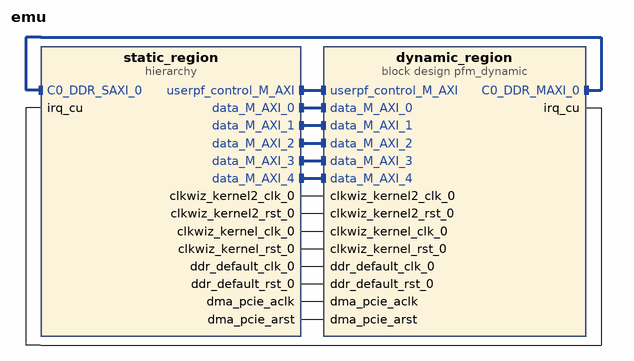
[diagram p0: block diagram of the top level]
# Vivado block design emu, xcvu9p-flgb2104-2-i, Vivado 2021.2
create_bd_design emu

create_bd_cell -type hier static_region
create_bd_cell -type container -reference pfm_dynamic dynamic_region

# ---- hierarchy /static_region ----
current_bd_instance /static_region
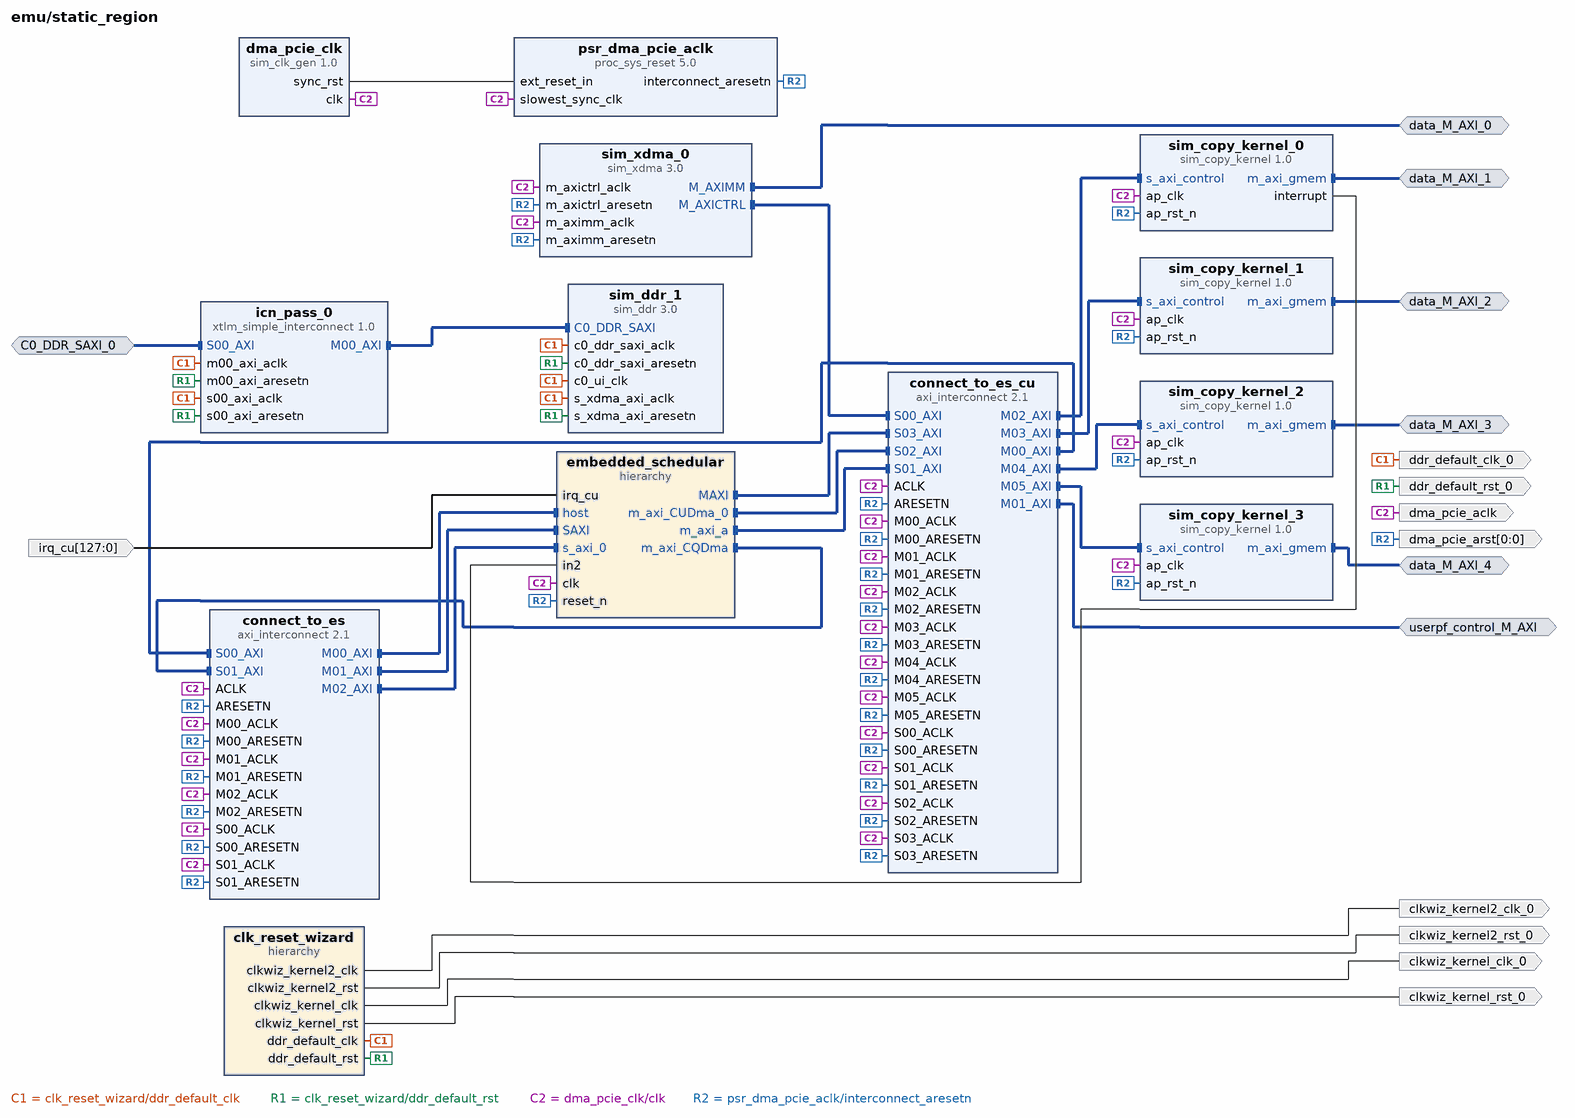
[diagram p1: block diagram inside /static_region]
create_bd_intf_pin -mode Slave -vlnv xilinx.com:interface:aximm_rtl:1.0 C0_DDR_SAXI_0
create_bd_intf_pin -mode Master -vlnv xilinx.com:interface:aximm_rtl:1.0 data_M_AXI_0
create_bd_intf_pin -mode Master -vlnv xilinx.com:interface:aximm_rtl:1.0 data_M_AXI_1
create_bd_intf_pin -mode Master -vlnv xilinx.com:interface:aximm_rtl:1.0 data_M_AXI_2
create_bd_intf_pin -mode Master -vlnv xilinx.com:interface:aximm_rtl:1.0 data_M_AXI_3
create_bd_intf_pin -mode Master -vlnv xilinx.com:interface:aximm_rtl:1.0 data_M_AXI_4
create_bd_intf_pin -mode Master -vlnv xilinx.com:interface:aximm_rtl:1.0 userpf_control_M_AXI
create_bd_pin -dir O -type clk clkwiz_kernel2_clk_0
create_bd_pin -dir O -type clk clkwiz_kernel_clk_0
create_bd_pin -dir O -type rst clkwiz_kernel2_rst_0
create_bd_pin -dir O -type rst clkwiz_kernel_rst_0
create_bd_pin -dir O -type clk ddr_default_clk_0
create_bd_pin -dir O -type rst ddr_default_rst_0
create_bd_pin -dir O -type clk dma_pcie_aclk
create_bd_pin -dir I -from 127 -to 0 -type intr irq_cu
create_bd_pin -dir O -from 0 -to 0 -type rst dma_pcie_arst

create_bd_cell -type hier clk_reset_wizard
create_bd_cell -type hier embedded_schedular
create_bd_cell -type ip -vlnv xilinx.com:ip:proc_sys_reset:5.0 psr_dma_pcie_aclk
create_bd_cell -type ip -vlnv xilinx.com:user:sim_ddr:3.0 sim_ddr_1
set_property -dict [list \
  CONFIG.C0_A00_BASE_ADDR 0x0 \
  CONFIG.C0_A00_HIGH_ADDR 0x0000000400000000 \
  CONFIG.C0_APP_ADDR_WIDTH 31 \
  CONFIG.C0_APP_DATA_WIDTH 512 \
  CONFIG.C0_BANK_GROUP_WIDTH 2 \
  CONFIG.C0_BANK_WIDTH 2 \
  CONFIG.C0_COLUMN_WIDTH 10 \
  CONFIG.C0_DATA_WIDTH 72 \
  CONFIG.C0_DDR_SAXI_ADDR_WIDTH 34 \
  CONFIG.C0_DDR_SAXI_BASEADDR 0x0000000000000000 \
  CONFIG.C0_DDR_SAXI_DATA_WIDTH 512 \
  CONFIG.C0_DDR_SAXI_HIGHADDR 0x0000000400000000 \
  CONFIG.C0_MEMORY_PART MTA18ASF2G72PZ-2G3 \
  CONFIG.C0_MEM_ADDR_MAP ROW_COLUMN_BANK \
  CONFIG.C0_Mem_Add_Map ROW_COLUMN_BANK \
  CONFIG.C0_RANK_WIDTH 1 \
  CONFIG.C0_ROW_WIDTH 17 \
  CONFIG.C0_SIZE 16GB \
  CONFIG.C0_TIMEPERIOD_PS 833 \
  CONFIG.C0_TYPE ddr4 \
  CONFIG.C0_tCK 833 \
  CONFIG.C0_tCKE 0 \
  CONFIG.C0_tFAW 16 \
  CONFIG.C0_tMRD 2 \
  CONFIG.C0_tRAS 39 \
  CONFIG.C0_tRCD 17 \
  CONFIG.C0_tREFI 9363 \
  CONFIG.C0_tRFC 421 \
  CONFIG.C0_tRP 17 \
  CONFIG.C0_tRRD_L 6 \
  CONFIG.C0_tRRD_S 4 \
  CONFIG.C0_tRTP 10 \
  CONFIG.C0_tWR 19 \
  CONFIG.C0_tWTR_L 10 \
  CONFIG.C0_tWTR_S 4 \
  CONFIG.C_NUMBER_OF_GLOBAL_MEMORIES 1 \
] [get_bd_cells sim_ddr_1]
create_bd_cell -type ip -vlnv xilinx.com:ip:xtlm_simple_interconnect:1.0 icn_pass_0
set_property -dict [list \
  CONFIG.C_M00_AXI_ADDR_WIDTH 34 \
  CONFIG.C_M00_AXI_DATA_WIDTH 512 \
  CONFIG.C_NUM_MI 1 \
  CONFIG.C_NUM_SI 1 \
  CONFIG.C_S00_AXI_ADDR_WIDTH 64 \
  CONFIG.C_S00_AXI_DATA_WIDTH 512 \
] [get_bd_cells icn_pass_0]
create_bd_cell -type ip -vlnv xilinx.com:hls:sim_copy_kernel:1.0 sim_copy_kernel_0
create_bd_cell -type ip -vlnv xilinx.com:hls:sim_copy_kernel:1.0 sim_copy_kernel_1
create_bd_cell -type ip -vlnv xilinx.com:hls:sim_copy_kernel:1.0 sim_copy_kernel_2
create_bd_cell -type ip -vlnv xilinx.com:hls:sim_copy_kernel:1.0 sim_copy_kernel_3
create_bd_cell -type ip -vlnv xilinx.com:ip:axi_interconnect:2.1 connect_to_es
set_property -dict {CONFIG.NUM_MI 3 CONFIG.NUM_SI 2} [get_bd_cells connect_to_es]
create_bd_cell -type ip -vlnv xilinx.com:ip:axi_interconnect:2.1 connect_to_es_cu
set_property -dict {CONFIG.NUM_MI 6 CONFIG.NUM_SI 4} [get_bd_cells connect_to_es_cu]
create_bd_cell -type ip -vlnv xilinx.com:ip:sim_clk_gen:1.0 dma_pcie_clk
set_property -dict {CONFIG.FREQ_HZ 300000000.0} [get_bd_cells dma_pcie_clk]
create_bd_cell -type ip -vlnv xilinx.com:xilinx:sim_xdma:3.0 sim_xdma_0
set_property -dict [list \
  CONFIG.C_M_AXICTRL_ADDR_WIDTH 64 \
  CONFIG.C_M_AXICTRL_DATA_WIDTH 32 \
  CONFIG.C_M_AXIMM_ADDR_WIDTH 64 \
  CONFIG.C_M_AXIMM_ARUSER_WIDTH 32 \
  CONFIG.C_M_AXIMM_AWUSER_WIDTH 32 \
  CONFIG.C_M_AXIMM_DATA_WIDTH 32 \
] [get_bd_cells sim_xdma_0]

# ---- hierarchy /static_region/clk_reset_wizard ----
current_bd_instance /static_region/clk_reset_wizard
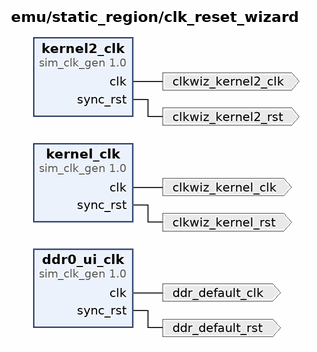
[diagram p2: block diagram inside /static_region/clk_reset_wizard]
create_bd_pin -dir O -type rst clkwiz_kernel2_rst
create_bd_pin -dir O -type rst clkwiz_kernel_rst
create_bd_pin -dir O -type clk ddr_default_clk
create_bd_pin -dir O -type rst ddr_default_rst
create_bd_pin -dir O -type clk clkwiz_kernel2_clk
create_bd_pin -dir O -type clk clkwiz_kernel_clk

create_bd_cell -type ip -vlnv xilinx.com:ip:sim_clk_gen:1.0 ddr0_ui_clk
set_property -dict {CONFIG.FREQ_HZ 300120048} [get_bd_cells ddr0_ui_clk]
create_bd_cell -type ip -vlnv xilinx.com:ip:sim_clk_gen:1.0 kernel2_clk
set_property -dict {CONFIG.FREQ_HZ 500000000} [get_bd_cells kernel2_clk]
create_bd_cell -type ip -vlnv xilinx.com:ip:sim_clk_gen:1.0 kernel_clk
set_property -dict {CONFIG.FREQ_HZ 300000000} [get_bd_cells kernel_clk]

# ---- hierarchy /static_region/embedded_schedular ----
current_bd_instance /static_region/embedded_schedular
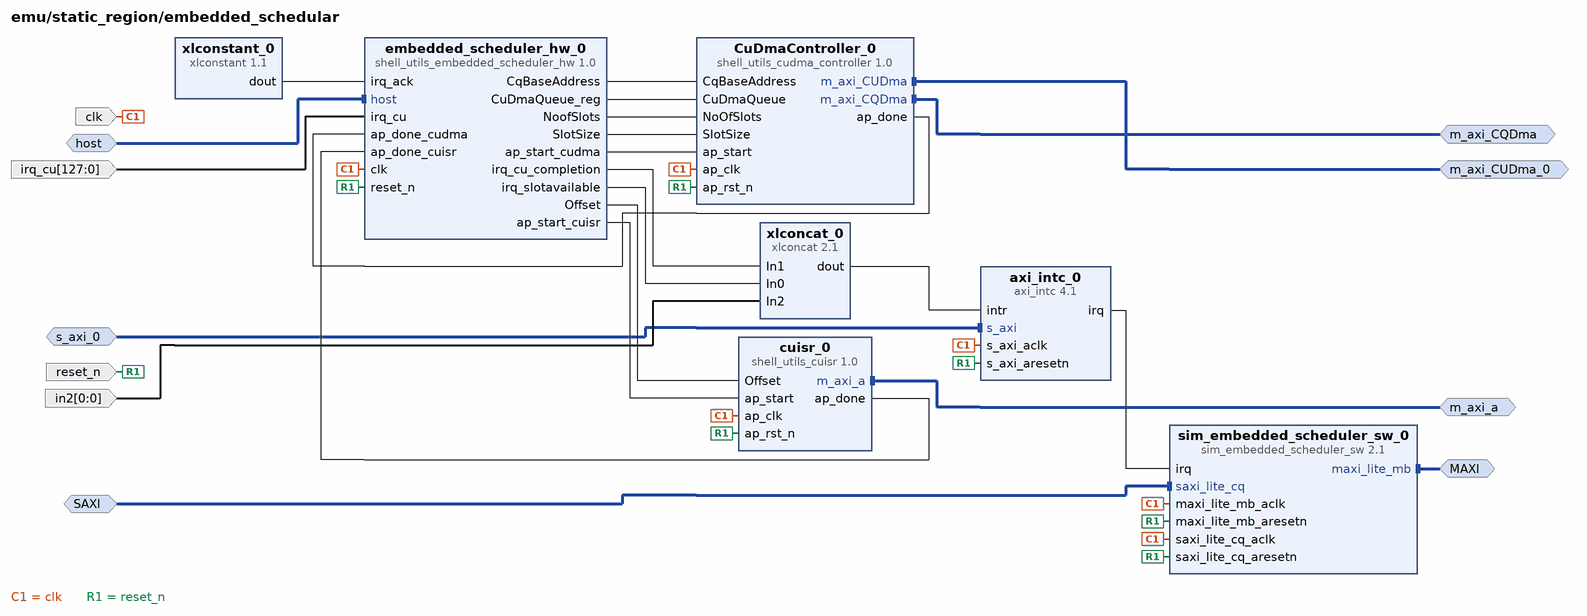
[diagram p3: block diagram inside /static_region/embedded_schedular]
create_bd_intf_pin -mode Master -vlnv xilinx.com:interface:aximm_rtl:1.0 MAXI
create_bd_intf_pin -mode Slave -vlnv xilinx.com:interface:aximm_rtl:1.0 SAXI
create_bd_intf_pin -mode Slave -vlnv xilinx.com:interface:aximm_rtl:1.0 host
create_bd_intf_pin -mode Master -vlnv xilinx.com:interface:aximm_rtl:1.0 m_axi_CQDma
create_bd_intf_pin -mode Master -vlnv xilinx.com:interface:aximm_rtl:1.0 m_axi_CUDma_0
create_bd_intf_pin -mode Master -vlnv xilinx.com:interface:aximm_rtl:1.0 m_axi_a
create_bd_intf_pin -mode Slave -vlnv xilinx.com:interface:aximm_rtl:1.0 s_axi_0
create_bd_pin -dir I -type clk clk
create_bd_pin -dir I -from 127 -to 0 -type intr irq_cu
create_bd_pin -dir I -type rst reset_n
create_bd_pin -dir I -from 0 -to 0 in2

create_bd_cell -type ip -vlnv xilinx.com:ip:shell_utils_embedded_scheduler_hw:1.0 embedded_scheduler_hw_0
create_bd_cell -type ip -vlnv xilinx.com:xilinx:sim_embedded_scheduler_sw:2.1 sim_embedded_scheduler_sw_0
create_bd_cell -type ip -vlnv xilinx.com:ip:shell_utils_cudma_controller:1.0 CuDmaController_0
create_bd_cell -type ip -vlnv xilinx.com:ip:axi_intc:4.1 axi_intc_0
set_property -dict [list \
  CONFIG.C_HAS_FAST 0 \
  CONFIG.C_IRQ_ACTIVE 1 \
  CONFIG.C_IRQ_IS_LEVEL 1 \
  CONFIG.C_KIND_OF_INTR 0xFFFFFFFC \
  CONFIG.C_KIND_OF_LVL 0xFFFFFFFF \
] [get_bd_cells axi_intc_0]
create_bd_cell -type ip -vlnv xilinx.com:ip:shell_utils_cuisr:1.0 cuisr_0
create_bd_cell -type ip -vlnv xilinx.com:ip:xlconcat:2.1 xlconcat_0
set_property -dict {CONFIG.NUM_PORTS 3 CONFIG.dout_width 3} [get_bd_cells xlconcat_0]
create_bd_cell -type ip -vlnv xilinx.com:ip:xlconstant:1.1 xlconstant_0
set_property -dict {CONFIG.CONST_VAL 0 CONFIG.CONST_WIDTH 16} [get_bd_cells xlconstant_0]

# ---- connections ----

current_bd_instance /static_region
connect_bd_intf_net [get_bd_intf_pins C0_DDR_SAXI_0] [get_bd_intf_pins icn_pass_0/S00_AXI]
connect_bd_intf_net [get_bd_intf_pins icn_pass_0/M00_AXI] [get_bd_intf_pins sim_ddr_1/C0_DDR_SAXI]
connect_bd_intf_net [get_bd_intf_pins connect_to_es/M00_AXI] [get_bd_intf_pins embedded_schedular/host]
connect_bd_intf_net [get_bd_intf_pins connect_to_es/M01_AXI] [get_bd_intf_pins embedded_schedular/SAXI]
connect_bd_intf_net [get_bd_intf_pins connect_to_es/M02_AXI] [get_bd_intf_pins embedded_schedular/s_axi_0]
connect_bd_intf_net [get_bd_intf_pins connect_to_es/S00_AXI] [get_bd_intf_pins connect_to_es_cu/M00_AXI]
connect_bd_intf_net [get_bd_intf_pins userpf_control_M_AXI] [get_bd_intf_pins connect_to_es_cu/M01_AXI]
connect_bd_intf_net [get_bd_intf_pins sim_copy_kernel_0/s_axi_control] [get_bd_intf_pins connect_to_es_cu/M02_AXI]
connect_bd_intf_net [get_bd_intf_pins sim_copy_kernel_1/s_axi_control] [get_bd_intf_pins connect_to_es_cu/M03_AXI]
connect_bd_intf_net [get_bd_intf_pins sim_copy_kernel_2/s_axi_control] [get_bd_intf_pins connect_to_es_cu/M04_AXI]
connect_bd_intf_net [get_bd_intf_pins sim_copy_kernel_3/s_axi_control] [get_bd_intf_pins connect_to_es_cu/M05_AXI]
connect_bd_intf_net -intf_net data_M_AXI_0_1_conn [get_bd_intf_pins data_M_AXI_0] [get_bd_intf_pins sim_xdma_0/M_AXIMM]
connect_bd_intf_net -intf_net data_M_AXI_1_1_conn [get_bd_intf_pins data_M_AXI_1] [get_bd_intf_pins sim_copy_kernel_0/m_axi_gmem]
connect_bd_intf_net -intf_net data_M_AXI_2_1_conn [get_bd_intf_pins data_M_AXI_2] [get_bd_intf_pins sim_copy_kernel_1/m_axi_gmem]
connect_bd_intf_net -intf_net data_M_AXI_3_1_conn [get_bd_intf_pins data_M_AXI_3] [get_bd_intf_pins sim_copy_kernel_2/m_axi_gmem]
connect_bd_intf_net -intf_net data_M_AXI_4_1_conn [get_bd_intf_pins data_M_AXI_4] [get_bd_intf_pins sim_copy_kernel_3/m_axi_gmem]
connect_bd_intf_net [get_bd_intf_pins connect_to_es_cu/S03_AXI] [get_bd_intf_pins embedded_schedular/MAXI]
connect_bd_intf_net [get_bd_intf_pins connect_to_es/S01_AXI] [get_bd_intf_pins embedded_schedular/m_axi_CQDma]
connect_bd_intf_net [get_bd_intf_pins connect_to_es_cu/S02_AXI] [get_bd_intf_pins embedded_schedular/m_axi_CUDma_0]
connect_bd_intf_net [get_bd_intf_pins connect_to_es_cu/S01_AXI] [get_bd_intf_pins embedded_schedular/m_axi_a]
connect_bd_intf_net [get_bd_intf_pins connect_to_es_cu/S00_AXI] [get_bd_intf_pins sim_xdma_0/M_AXICTRL]
connect_bd_net [get_bd_pins clk_reset_wizard/clkwiz_kernel2_clk] [get_bd_pins clkwiz_kernel2_clk_0]
connect_bd_net [get_bd_pins clk_reset_wizard/clkwiz_kernel2_rst] [get_bd_pins clkwiz_kernel2_rst_0]
connect_bd_net [get_bd_pins clk_reset_wizard/clkwiz_kernel_clk] [get_bd_pins clkwiz_kernel_clk_0]
connect_bd_net [get_bd_pins clk_reset_wizard/clkwiz_kernel_rst] [get_bd_pins clkwiz_kernel_rst_0]
connect_bd_net [get_bd_pins clk_reset_wizard/ddr_default_clk] \
  [get_bd_pins ddr_default_clk_0] [get_bd_pins sim_ddr_1/c0_ddr_saxi_aclk] [get_bd_pins icn_pass_0/s00_axi_aclk] \
  [get_bd_pins icn_pass_0/m00_axi_aclk] [get_bd_pins sim_ddr_1/c0_ui_clk] [get_bd_pins sim_ddr_1/s_xdma_axi_aclk]
connect_bd_net [get_bd_pins clk_reset_wizard/ddr_default_rst] \
  [get_bd_pins ddr_default_rst_0] [get_bd_pins sim_ddr_1/c0_ddr_saxi_aresetn] [get_bd_pins icn_pass_0/s00_axi_aresetn] \
  [get_bd_pins icn_pass_0/m00_axi_aresetn] [get_bd_pins sim_ddr_1/s_xdma_axi_aresetn]
connect_bd_net [get_bd_pins irq_cu] [get_bd_pins embedded_schedular/irq_cu]
connect_bd_net -net pcie_dma [get_bd_pins dma_pcie_clk/sync_rst] [get_bd_pins psr_dma_pcie_aclk/ext_reset_in]
connect_bd_net -net pcie_dma_aclk [get_bd_pins dma_pcie_clk/clk] \
  [get_bd_pins dma_pcie_aclk] [get_bd_pins embedded_schedular/clk] [get_bd_pins psr_dma_pcie_aclk/slowest_sync_clk] \
  [get_bd_pins sim_copy_kernel_0/ap_clk] [get_bd_pins sim_copy_kernel_1/ap_clk] [get_bd_pins sim_copy_kernel_2/ap_clk] \
  [get_bd_pins sim_copy_kernel_3/ap_clk] [get_bd_pins connect_to_es/ACLK] [get_bd_pins connect_to_es/S00_ACLK] \
  [get_bd_pins connect_to_es/M00_ACLK] [get_bd_pins connect_to_es/M01_ACLK] [get_bd_pins connect_to_es/S01_ACLK] \
  [get_bd_pins connect_to_es/M02_ACLK] [get_bd_pins connect_to_es_cu/ACLK] [get_bd_pins connect_to_es_cu/S00_ACLK] \
  [get_bd_pins connect_to_es_cu/M00_ACLK] [get_bd_pins connect_to_es_cu/M01_ACLK] [get_bd_pins connect_to_es_cu/S01_ACLK] \
  [get_bd_pins connect_to_es_cu/S02_ACLK] [get_bd_pins connect_to_es_cu/S03_ACLK] [get_bd_pins connect_to_es_cu/M02_ACLK] \
  [get_bd_pins connect_to_es_cu/M03_ACLK] [get_bd_pins connect_to_es_cu/M04_ACLK] [get_bd_pins connect_to_es_cu/M05_ACLK] \
  [get_bd_pins sim_xdma_0/m_aximm_aclk] [get_bd_pins sim_xdma_0/m_axictrl_aclk]
connect_bd_net -net psr_dma_pcie_aclk_mb_reset [get_bd_pins psr_dma_pcie_aclk/interconnect_aresetn] \
  [get_bd_pins dma_pcie_arst] [get_bd_pins embedded_schedular/reset_n] [get_bd_pins sim_copy_kernel_0/ap_rst_n] \
  [get_bd_pins sim_copy_kernel_1/ap_rst_n] [get_bd_pins sim_copy_kernel_2/ap_rst_n] [get_bd_pins sim_copy_kernel_3/ap_rst_n] \
  [get_bd_pins connect_to_es/ARESETN] [get_bd_pins connect_to_es/S00_ARESETN] [get_bd_pins connect_to_es/M00_ARESETN] \
  [get_bd_pins connect_to_es/M01_ARESETN] [get_bd_pins connect_to_es/S01_ARESETN] [get_bd_pins connect_to_es/M02_ARESETN] \
  [get_bd_pins connect_to_es_cu/ARESETN] [get_bd_pins connect_to_es_cu/S00_ARESETN] \
  [get_bd_pins connect_to_es_cu/M00_ARESETN] [get_bd_pins connect_to_es_cu/M01_ARESETN] \
  [get_bd_pins connect_to_es_cu/S01_ARESETN] [get_bd_pins connect_to_es_cu/S02_ARESETN] \
  [get_bd_pins connect_to_es_cu/S03_ARESETN] [get_bd_pins connect_to_es_cu/M02_ARESETN] \
  [get_bd_pins connect_to_es_cu/M03_ARESETN] [get_bd_pins connect_to_es_cu/M04_ARESETN] \
  [get_bd_pins connect_to_es_cu/M05_ARESETN] [get_bd_pins sim_xdma_0/m_aximm_aresetn] \
  [get_bd_pins sim_xdma_0/m_axictrl_aresetn]
connect_bd_net [get_bd_pins sim_copy_kernel_0/interrupt] [get_bd_pins embedded_schedular/in2]

current_bd_instance /static_region/clk_reset_wizard
connect_bd_net [get_bd_pins ddr0_ui_clk/clk] [get_bd_pins ddr_default_clk]
connect_bd_net [get_bd_pins ddr0_ui_clk/sync_rst] [get_bd_pins ddr_default_rst]
connect_bd_net [get_bd_pins kernel2_clk/clk] [get_bd_pins clkwiz_kernel2_clk]
connect_bd_net [get_bd_pins kernel2_clk/sync_rst] [get_bd_pins clkwiz_kernel2_rst]
connect_bd_net [get_bd_pins kernel_clk/clk] [get_bd_pins clkwiz_kernel_clk]
connect_bd_net [get_bd_pins kernel_clk/sync_rst] [get_bd_pins clkwiz_kernel_rst]

current_bd_instance /static_region/embedded_schedular
connect_bd_intf_net [get_bd_intf_pins m_axi_CUDma_0] [get_bd_intf_pins CuDmaController_0/m_axi_CUDma]
connect_bd_intf_net [get_bd_intf_pins s_axi_0] [get_bd_intf_pins axi_intc_0/s_axi]
connect_bd_intf_net -intf_net S01_AXI_1 [get_bd_intf_pins m_axi_CQDma] [get_bd_intf_pins CuDmaController_0/m_axi_CQDma]
connect_bd_intf_net [get_bd_intf_pins SAXI] [get_bd_intf_pins sim_embedded_scheduler_sw_0/saxi_lite_cq]
connect_bd_intf_net -intf_net axi_interconnect_0_M00_AXI [get_bd_intf_pins host] [get_bd_intf_pins embedded_scheduler_hw_0/host]
connect_bd_intf_net [get_bd_intf_pins m_axi_a] [get_bd_intf_pins cuisr_0/m_axi_a]
connect_bd_intf_net [get_bd_intf_pins MAXI] [get_bd_intf_pins sim_embedded_scheduler_sw_0/maxi_lite_mb]
connect_bd_net [get_bd_pins CuDmaController_0/ap_done] [get_bd_pins embedded_scheduler_hw_0/ap_done_cudma]
connect_bd_net -net IN2_0 [get_bd_pins in2] [get_bd_pins xlconcat_0/In2]
connect_bd_net [get_bd_pins axi_intc_0/irq] [get_bd_pins sim_embedded_scheduler_sw_0/irq]
connect_bd_net [get_bd_pins cuisr_0/ap_done] [get_bd_pins embedded_scheduler_hw_0/ap_done_cuisr]
connect_bd_net -net dma_pcie_aclk_clk [get_bd_pins clk] \
  [get_bd_pins embedded_scheduler_hw_0/clk] [get_bd_pins sim_embedded_scheduler_sw_0/maxi_lite_mb_aclk] \
  [get_bd_pins sim_embedded_scheduler_sw_0/saxi_lite_cq_aclk] [get_bd_pins CuDmaController_0/ap_clk] \
  [get_bd_pins axi_intc_0/s_axi_aclk] [get_bd_pins cuisr_0/ap_clk]
connect_bd_net -net dma_pcie_aclk_sync_rst [get_bd_pins reset_n] \
  [get_bd_pins embedded_scheduler_hw_0/reset_n] [get_bd_pins sim_embedded_scheduler_sw_0/maxi_lite_mb_aresetn] \
  [get_bd_pins sim_embedded_scheduler_sw_0/saxi_lite_cq_aresetn] [get_bd_pins CuDmaController_0/ap_rst_n] \
  [get_bd_pins axi_intc_0/s_axi_aresetn] [get_bd_pins cuisr_0/ap_rst_n]
connect_bd_net [get_bd_pins embedded_scheduler_hw_0/CqBaseAddress] [get_bd_pins CuDmaController_0/CqBaseAddress]
connect_bd_net [get_bd_pins embedded_scheduler_hw_0/CuDmaQueue_reg] [get_bd_pins CuDmaController_0/CuDmaQueue]
connect_bd_net [get_bd_pins embedded_scheduler_hw_0/NoofSlots] [get_bd_pins CuDmaController_0/NoOfSlots]
connect_bd_net [get_bd_pins embedded_scheduler_hw_0/SlotSize] [get_bd_pins CuDmaController_0/SlotSize]
connect_bd_net -net embedded_scheduler_hw_0_ap_offset_cuisr [get_bd_pins embedded_scheduler_hw_0/Offset] [get_bd_pins cuisr_0/Offset]
connect_bd_net [get_bd_pins embedded_scheduler_hw_0/ap_start_cudma] [get_bd_pins CuDmaController_0/ap_start]
connect_bd_net [get_bd_pins embedded_scheduler_hw_0/ap_start_cuisr] [get_bd_pins cuisr_0/ap_start]
connect_bd_net [get_bd_pins embedded_scheduler_hw_0/irq_cu_completion] [get_bd_pins xlconcat_0/In1]
connect_bd_net [get_bd_pins embedded_scheduler_hw_0/irq_slotavailable] [get_bd_pins xlconcat_0/In0]
connect_bd_net [get_bd_pins irq_cu] [get_bd_pins embedded_scheduler_hw_0/irq_cu]
connect_bd_net [get_bd_pins xlconcat_0/dout] [get_bd_pins axi_intc_0/intr]
connect_bd_net [get_bd_pins xlconstant_0/dout] [get_bd_pins embedded_scheduler_hw_0/irq_ack]

current_bd_instance /
connect_bd_intf_net -intf_net sta_dy_ctrl0 [get_bd_intf_pins static_region/userpf_control_M_AXI] [get_bd_intf_pins dynamic_region/userpf_control_M_AXI]
connect_bd_intf_net -intf_net sta_dy_data0 [get_bd_intf_pins static_region/data_M_AXI_0] [get_bd_intf_pins dynamic_region/data_M_AXI_0]
connect_bd_intf_net -intf_net sta_dy_data1 [get_bd_intf_pins static_region/data_M_AXI_1] [get_bd_intf_pins dynamic_region/data_M_AXI_1]
connect_bd_intf_net -intf_net sta_dy_data2 [get_bd_intf_pins static_region/data_M_AXI_2] [get_bd_intf_pins dynamic_region/data_M_AXI_2]
connect_bd_intf_net -intf_net sta_dy_data3 [get_bd_intf_pins static_region/data_M_AXI_3] [get_bd_intf_pins dynamic_region/data_M_AXI_3]
connect_bd_intf_net -intf_net sta_dy_data4 [get_bd_intf_pins static_region/data_M_AXI_4] [get_bd_intf_pins dynamic_region/data_M_AXI_4]
connect_bd_intf_net -intf_net sta_dy_ddr1 [get_bd_intf_pins static_region/C0_DDR_SAXI_0] [get_bd_intf_pins dynamic_region/C0_DDR_MAXI_0]
connect_bd_net -net irq_cu_conn [get_bd_pins dynamic_region/irq_cu] [get_bd_pins static_region/irq_cu]
connect_bd_net [get_bd_pins static_region/clkwiz_kernel2_clk_0] [get_bd_pins dynamic_region/clkwiz_kernel2_clk_0]
connect_bd_net [get_bd_pins static_region/clkwiz_kernel2_rst_0] [get_bd_pins dynamic_region/clkwiz_kernel2_rst_0]
connect_bd_net [get_bd_pins static_region/clkwiz_kernel_clk_0] [get_bd_pins dynamic_region/clkwiz_kernel_clk_0]
connect_bd_net [get_bd_pins static_region/clkwiz_kernel_rst_0] [get_bd_pins dynamic_region/clkwiz_kernel_rst_0]
connect_bd_net [get_bd_pins static_region/ddr_default_clk_0] [get_bd_pins dynamic_region/ddr_default_clk_0]
connect_bd_net [get_bd_pins static_region/ddr_default_rst_0] [get_bd_pins dynamic_region/ddr_default_rst_0]
connect_bd_net [get_bd_pins static_region/dma_pcie_aclk] [get_bd_pins dynamic_region/dma_pcie_aclk]
connect_bd_net [get_bd_pins static_region/dma_pcie_arst] [get_bd_pins dynamic_region/dma_pcie_arst]

# ---- address map ----
assign_bd_address -offset 0x00180000 -range 4K -target_address_space [get_bd_addr_spaces static_region/embedded_schedular/sim_embedded_scheduler_sw_0/maxi_lite_mb] [get_bd_addr_segs static_region/embedded_schedular/embedded_scheduler_hw_0/host/reg0]
assign_bd_address -offset 0x00190000 -range 64K -target_address_space [get_bd_addr_spaces static_region/embedded_schedular/sim_embedded_scheduler_sw_0/maxi_lite_mb] [get_bd_addr_segs static_region/embedded_schedular/sim_embedded_scheduler_sw_0/saxi_lite_cq/saxi_lite_cq_reg]
assign_bd_address -offset 0x1C000000 -range 64M -target_address_space [get_bd_addr_spaces static_region/embedded_schedular/sim_embedded_scheduler_sw_0/maxi_lite_mb] [get_bd_addr_segs dynamic_region/userpf_control_M_AXI/Reg0]
assign_bd_address -offset 0x41200000 -range 64K -target_address_space [get_bd_addr_spaces static_region/embedded_schedular/sim_embedded_scheduler_sw_0/maxi_lite_mb] [get_bd_addr_segs static_region/embedded_schedular/axi_intc_0/S_AXI/Reg]
assign_bd_address -offset 0x0000000000180000 -range 4K -target_address_space [get_bd_addr_spaces static_region/sim_xdma_0/M_AXICTRL] [get_bd_addr_segs static_region/embedded_schedular/embedded_scheduler_hw_0/host/reg0]
assign_bd_address -offset 0x0000000000190000 -range 64K -target_address_space [get_bd_addr_spaces static_region/sim_xdma_0/M_AXICTRL] [get_bd_addr_segs static_region/embedded_schedular/sim_embedded_scheduler_sw_0/saxi_lite_cq/saxi_lite_cq_reg]
assign_bd_address -offset 0x000000001C000000 -range 64M -target_address_space [get_bd_addr_spaces static_region/sim_xdma_0/M_AXICTRL] [get_bd_addr_segs dynamic_region/userpf_control_M_AXI/Reg0]

validate_bd_design
save_bd_design
